# Altium schematic sheet imu.SchDoc
size A
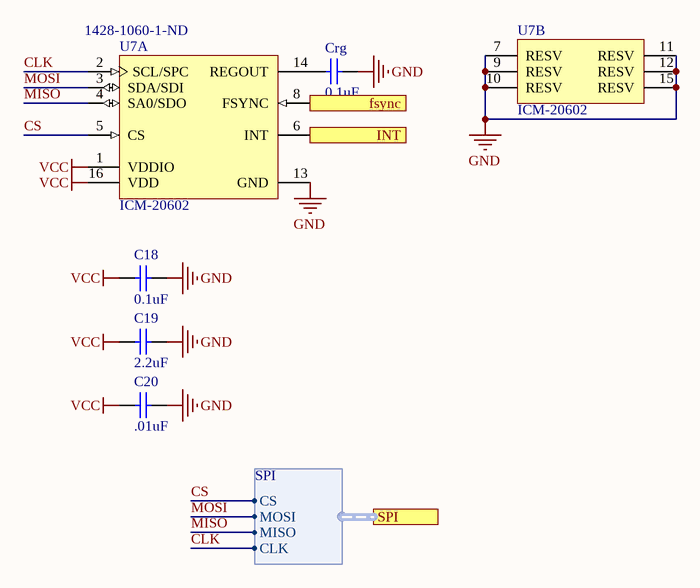
[diagram p0: imu.SchDoc]

## Parts
C18  value 0.1uF  [0402]  (hidden comment: Cap)
C19  value 2.2uF  [0402]  (hidden comment: Cap)
C20  value .01uF  [0402]  (hidden comment: Cap)
Crg  value 0.1uF  [0402]  (hidden comment: Cap)
U7  ICM-20602  Supplier Part Number 1: 1428-1060-1-ND  [INSE-I62-16]  (parts A,B of 2)

## Ports
fsync (in), INT (out), SPI (harness SPI)

## Harnesses
SPI: CS, MOSI, MISO, CLK

## Nets
GND: C18.2 C19.2 C20.2 Crg.2 U7.7(RESV) U7.9(RESV) U7.10(RESV) U7.11(RESV) U7.12(RESV) U7.13(GND) U7.15(RESV)
VCC: C18.1 C19.1 C20.1 U7.1(VDDIO) U7.16(VDD)
CLK: U7.2(SCL/SPC) ; port SPI.CLK
CS: U7.5(CS) ; port SPI.CS
fsync: U7.8(FSYNC) ; port fsync
INT: U7.6(INT) ; port INT
MISO: U7.4(SA0/SDO) ; port SPI.MISO
MOSI: U7.3(SDA/SDI) ; port SPI.MOSI
NetCrg_1: Crg.1 U7.14(REGOUT)

## Library data of the parts
C18-C20 Crg = Cap: Ceramic Capacitor (Surface Mount); Manufacturer: Generic Ceramic Chip Cap (TBD); Digi-Key Part Number: *; Manufacturer Part Number: *; Note: *; Rating: *
U7 = CMP-2000-07589-1: High Performance 6-Axis MEMS MotionTracking(TM) Device, 1.71 to 3.45 V, -40 to 85 degC, 16-Pin LGA, RoHS; Manufacturer: InvenSense; Sensor Type: Temperature; Output Type: I2C; RoHSCompliant: True; Datasheet Version: Rev. 1.0, 10/2016; Datasheet URL: http://www.invensense.com/wp-content/uploads/2016/10/DS-000176-ICM-20602-v1.0.pdf; Min Operating Temperature: -40degC; Mounting Technology: SurfaceMount; Max Operating Temperature: 85degC; Manufacturer URL: http://www.invensense.com/; Package Reference: I62-16; Package Description: 16-Pin Land Grid Array, Body 3 x 3 mm, Pitch 0.5 mm; Supplier 1: Digi-Key